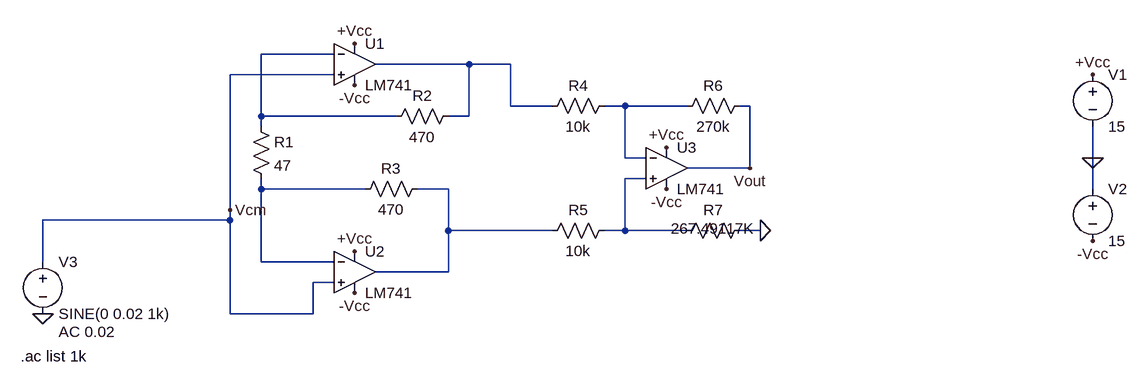
[diagram p0: schematic common mode.asc]
common mode.asc, the LTspice schematic file:
Version 4
SHEET 1 880 680
WIRE -688 -32 -800 -32
WIRE -480 -16 -624 -16
WIRE -416 -16 -480 -16
WIRE -688 0 -848 0
WIRE -416 48 -416 -16
WIRE -352 48 -416 48
WIRE -240 48 -272 48
WIRE -144 48 -240 48
WIRE -48 48 -64 48
WIRE -800 64 -800 -32
WIRE -592 64 -800 64
WIRE -480 64 -480 -16
WIRE -480 64 -512 64
WIRE -800 80 -800 64
WIRE -240 128 -240 48
WIRE -208 128 -240 128
WIRE 480 128 480 80
WIRE -48 144 -48 48
WIRE -48 144 -144 144
WIRE -208 160 -240 160
WIRE -800 176 -800 160
WIRE -640 176 -800 176
WIRE -512 176 -560 176
WIRE 480 176 480 128
WIRE -848 208 -848 0
WIRE -848 224 -848 208
WIRE -848 224 -1136 224
WIRE -512 240 -512 176
WIRE -352 240 -512 240
WIRE -240 240 -240 160
WIRE -240 240 -272 240
WIRE -144 240 -240 240
WIRE -32 240 -64 240
WIRE -1136 288 -1136 224
WIRE -800 288 -800 176
WIRE -688 288 -800 288
WIRE -512 304 -512 240
WIRE -512 304 -624 304
WIRE -688 320 -720 320
WIRE -848 368 -848 224
WIRE -720 368 -720 320
WIRE -720 368 -848 368
FLAG 480 128 0
FLAG 480 0 +Vcc
FLAG 480 256 -Vcc
FLAG -656 -48 +Vcc
FLAG -656 16 -Vcc
FLAG -656 272 +Vcc
FLAG -656 336 -Vcc
FLAG -1136 368 0
FLAG -32 240 0
FLAG -176 112 +Vcc
FLAG -176 176 -Vcc
FLAG -48 144 Vout
FLAG -848 208 Vcm
SYMBOL voltage 480 -16 R0
WINDOW 123 0 0 Left 0
WINDOW 39 0 0 Left 0
SYMATTR InstName V1
SYMATTR Value 15
SYMBOL voltage 480 160 R0
WINDOW 123 0 0 Left 0
WINDOW 39 0 0 Left 0
SYMATTR InstName V2
SYMATTR Value 15
SYMBOL OpAmps\\LM741 -656 -80 R0
SYMATTR InstName U1
SYMBOL OpAmps\\LM741 -656 240 R0
SYMATTR InstName U2
SYMBOL res -816 64 R0
SYMATTR InstName R1
SYMATTR Value 47
SYMBOL res -496 48 R90
WINDOW 0 0 56 VBottom 2
WINDOW 3 32 56 VTop 2
SYMATTR InstName R2
SYMATTR Value 470
SYMBOL res -544 160 R90
WINDOW 0 0 56 VBottom 2
WINDOW 3 32 56 VTop 2
SYMATTR InstName R3
SYMATTR Value 470
SYMBOL voltage -1136 272 R0
WINDOW 123 24 124 Left 2
WINDOW 39 0 0 Left 0
SYMATTR InstName V3
SYMATTR Value SINE(0 0.02 1k)
SYMATTR Value2 AC 0.02
SYMBOL res -256 32 R90
WINDOW 0 0 56 VBottom 2
WINDOW 3 32 56 VTop 2
SYMATTR InstName R4
SYMATTR Value 10k
SYMBOL res -256 224 R90
WINDOW 0 0 56 VBottom 2
WINDOW 3 32 56 VTop 2
SYMATTR InstName R5
SYMATTR Value 10k
SYMBOL res -48 32 R90
WINDOW 0 0 56 VBottom 2
WINDOW 3 32 56 VTop 2
SYMATTR InstName R6
SYMATTR Value 270k
SYMBOL res -48 224 R90
WINDOW 0 0 56 VBottom 2
WINDOW 3 28 56 VBottom 2
SYMATTR InstName R7
SYMATTR Value 267.49117K
SYMBOL OpAmps\\LM741 -176 80 R0
SYMATTR InstName U3
TEXT -1170 434 Left 2 !.ac list 1k

The netlist it stands for:
* common mode.asc
V1 +Vcc 0 15
V2 0 -Vcc 15
XU1 Vcm N001 +Vcc -Vcc N002 LM741  ; pins In+ In- V+ V- OUT
XU2 Vcm N005 +Vcc -Vcc N006 LM741  ; pins In+ In- V+ V- OUT
R1 N001 N005 47
R2 N002 N001 470
R3 N006 N005 470
V3 Vcm 0 SINE(0 0.02 1k) AC 0.02
R4 N003 N002 10k
R5 N004 N006 10k
R6 Vout N003 270k
R7 0 N004 267.49117K
XU3 N004 N003 +Vcc -Vcc Vout LM741  ; pins In+ In- V+ V- OUT
.ac list 1k
.lib LM741.lib
.backanno
.end